# EasyEDA Pro project compute-module-v101.eprj, schematic mod-gravity
Board Name: mod-gravity; Create Date: 2025-12-05; Page Name: P1; Project Name: compute-module-v101; Schematic Name: mod-gravity; Update Date: 2025-12-05; Company: EasyEDA.com; Page Size: A4; Version: V1.0
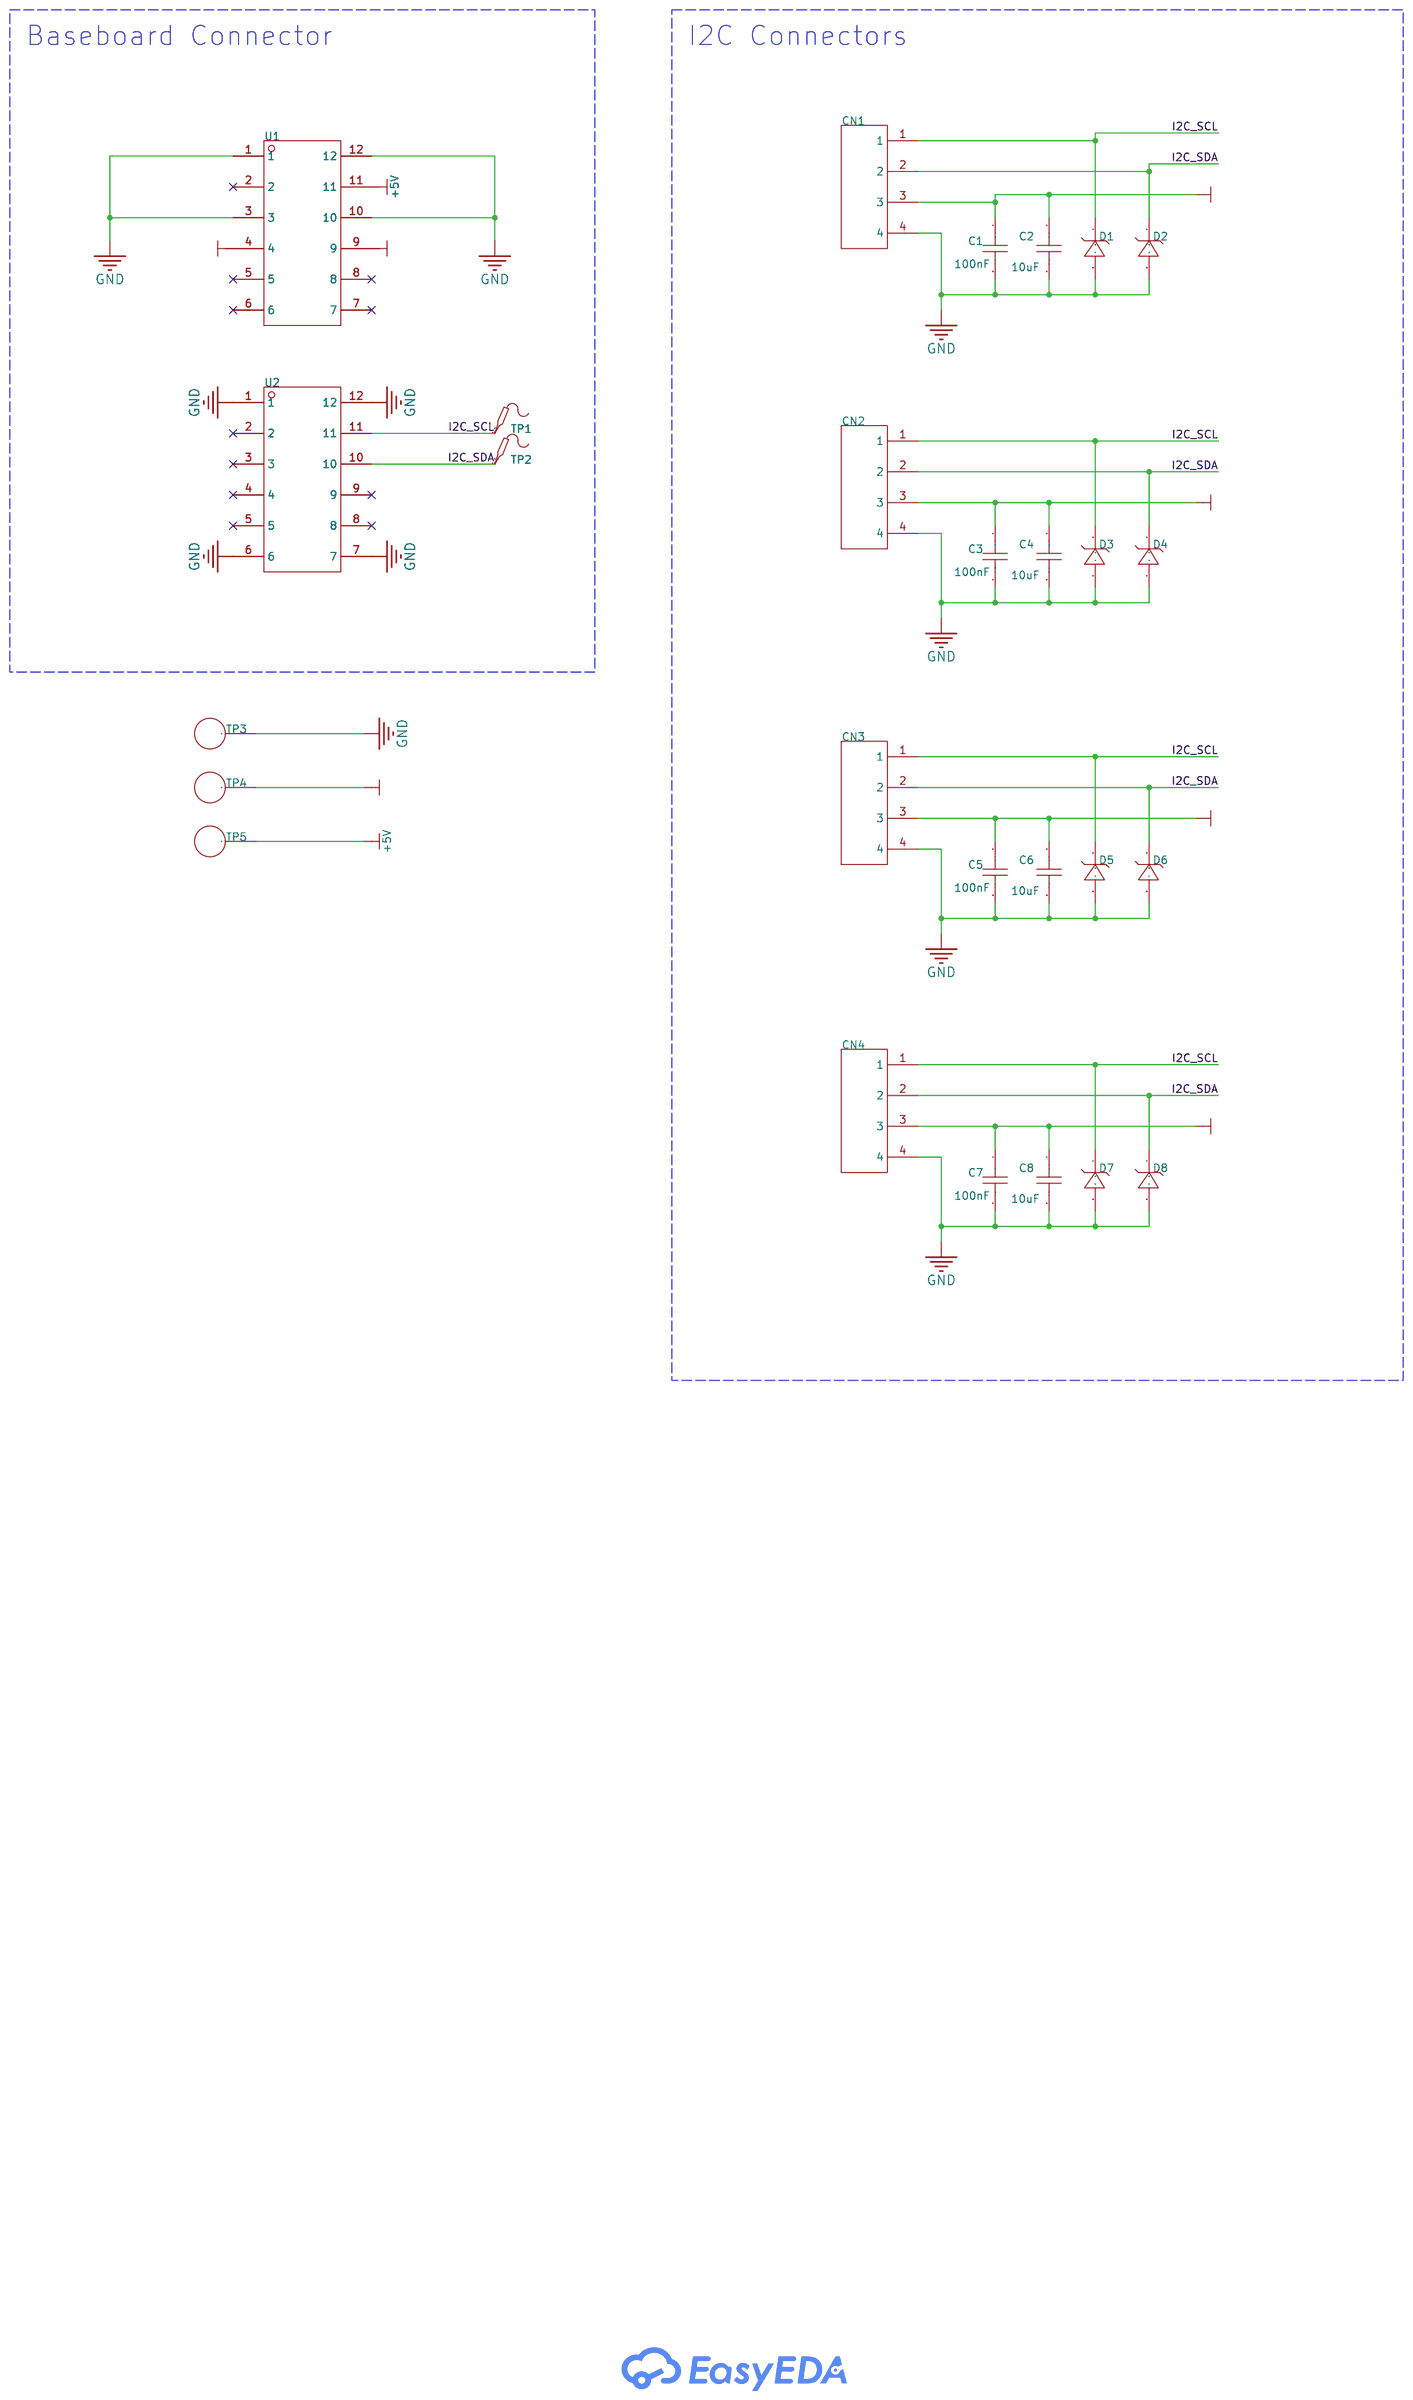
[diagram p4: schematic sheet]

## Parts
C1  100nF  [C0603]
C2  10uF  [C0603]
C3  100nF  [C0603]
C4  10uF  [C0603]
C5  100nF  [C0603]
C6  10uF  [C0603]
C7  100nF  [C0603]
C8  10uF  [C0603]
CN1  B4B-PH-K-S(LF)(SN)  [CONN-TH_B4B-PH-K-S]
CN2  B4B-PH-K-S(LF)(SN)  [CONN-TH_B4B-PH-K-S]
CN3  B4B-PH-K-S(LF)(SN)  [CONN-TH_B4B-PH-K-S]
CN4  B4B-PH-K-S(LF)(SN)  [CONN-TH_B4B-PH-K-S]
D1  PESD5V0U1UA,115  [SOD-323_L1.8-W1.3-LS2.5-RD]
D2  PESD5V0U1UA,115  [SOD-323_L1.8-W1.3-LS2.5-RD]
D3  PESD5V0U1UA,115  [SOD-323_L1.8-W1.3-LS2.5-RD]
D4  PESD5V0U1UA,115  [SOD-323_L1.8-W1.3-LS2.5-RD]
D5  PESD5V0U1UA,115  [SOD-323_L1.8-W1.3-LS2.5-RD]
D6  PESD5V0U1UA,115  [SOD-323_L1.8-W1.3-LS2.5-RD]
D7  PESD5V0U1UA,115  [SOD-323_L1.8-W1.3-LS2.5-RD]
D8  PESD5V0U1UA,115  [SOD-323_L1.8-W1.3-LS2.5-RD]
TP1  -  [Test-Point-0.5mm]
TP2  -  [Test-Point-0.5mm]
TP3  RH-5004  [TESTPOINT_TH_BD2.5-D1.2]
TP4  RH-5004  [TESTPOINT_TH_BD2.5-D1.2]
TP5  RH-5004  [TESTPOINT_TH_BD2.5-D1.2]
U1  -  [ED12BGFBK-CARD]
U2  -  [ED12BGFBK-CARD]

## Library data of the parts
C1 C3 C5 C7 = CC0603KRX7R9BB104: Capacitance:100nF Tolerance:±10% Tolerance:±10% Voltage Rating:50V Temperature Coefficient:X7R; LCSC Part Name: 100nF ±10% 50V; Supplier Part: C14663; Manufacturer: YAGEO(国巨); Supplier Footprint: 0603; JLCPCB Part Class: Basic Part; Datasheet: https://item.szlcsc.com/datasheet/CC0603KRX7R9BB104/15331.html; Supplier: LCSC; Tolerance: ±10%; Voltage Rating: 50V; Temperature Coefficient: X7R
C2 C4 C6 C8 = CL10A106MA8NRNC: Capacitance:10uF Tolerance:±20% Tolerance:±20% Voltage Rating:25V Temperature Coefficient:X5R; LCSC Part Name: 10uF ±20% 25V; Supplier Part: C96446; Manufacturer: SAMSUNG(三星); Supplier Footprint: 0603; JLCPCB Part Class: Basic Part; Datasheet: https://item.szlcsc.com/datasheet/CL10A106MA8NRNC/97651.html; Supplier: LCSC; Tolerance: ±20%; Voltage Rating: 25V; Temperature Coefficient: X5R
CN1-CN4 = B4B-PH-K-S(LF)(SN)_C131334: LCSC Part Name: 1x4P 间距:2mm 直插 系列:PH; Supplier Part: C131334; Manufacturer: JST; Supplier Footprint: 插件,P=2mm; JLCPCB Part Class: Extended Part; Datasheet: https://item.szlcsc.com/datasheet/B4B-PH-K-S(LF)(SN)/142627.html; Supplier: LCSC; Pins Structure: 1x4P; Pitch: 2mm; Mounting Type: Through Hole; Reference Series: PH; Number of Pins: 4P; Number of Rows: 1; Number of PINs Per Row: 4; Current Rating: 2A; Contact Material: Brass; Contact Plating: Tin; Operating Temperature: -25℃~+85℃; Voltage Rating: 100V; Plastic Material: PA66; Flame Retardant Rating: UL94V-0; Supplementary Features: K Pin; Color: White; Z-Height of the Board: 6mm; X-Length of Bottom Edge on Board (Spacing Line): 9.9mm; Y-Width of Bottom Edge on Board: 4.5mm
D1-D8 = PESD5V0U1UA,115: LCSC Part Name: 单向ESD; Supplier Part: C139614; Manufacturer: Nexperia(安世); Supplier Footprint: SOD-323; JLCPCB Part Class: Extended Part; Datasheet: https://item.szlcsc.com/datasheet/PESD5V0U1UA%252C115/150939.html; Supplier: LCSC; Polarity: Unidirectional; Reverse Stand-Off Voltage (Vrwm): 5V; Clamping Voltage: 11V; Peak Pulse Current (Ipp): 1.3A@8/20us; Voltage - Breakdown: 8.8V; Reverse Leakage Current (Ir): 1nA; Number of Channels: 1; Operating Temperature: -55℃~+150℃@(Ta); level of protection: IEC 61000-4-2; Type: ESD; Junction Capacitance: 2pF
TP1 TP2 = Test-Point
TP3-TP5 = RH-5004: Connector Type:Pin type (through board) Plastic Color:Yellow Board Space (Diameter φ/ Length x Width):2.5mm; LCSC Part Name: PCB电路板测试点/测试针; Supplier Part: C5199804; Manufacturer: 荣和; JLCPCB Part Class: Extended Part; Supplier: LCSC; Connector Type: Pin type (through board); Plastic Color: Yellow; Board Space (Diameter φ/ Length x Width): 2.5mm
U1 U2 = ED12BGFBK-CARD

## Nets
+3V3: C1.1 C2.1 C3.1 C4.1 C5.1 C6.1 C7.1 C8.1 CN1.3 CN2.3 CN3.3 CN4.3 TP4.1 U1.4 U1.9
+5V: TP5.1 U1.11
GND: C1.2 C2.2 C3.2 C4.2 C5.2 C6.2 C7.2 C8.2 CN1.4 CN2.4 CN3.4 CN4.4 D1.2(A) D2.2(A) D3.2(A) D4.2(A) D5.2(A) D6.2(A) D7.2(A) D8.2(A) TP3.1 U1.1 U1.3 U1.10 U1.12 U2.1 U2.6 U2.7 U2.12
I2C_SCL: CN1.1 CN2.1 CN3.1 CN4.1 D1.1(C) D3.1(C) D5.1(C) D7.1(C) TP1.1 U2.11
I2C_SDA: CN1.2 CN2.2 CN3.2 CN4.2 D2.1(C) D4.1(C) D6.1(C) D8.1(C) TP2.1 U2.10

Not connected (* = marked no-connect by the designer): U1 2* 5* 6* 7* 8*; U2 2* 3* 4* 5* 8* 9*

## Notes on the sheet
- Baseboard Connector
- I2C Connectors
